# Altium schematic sheet TK512_Optisk_Mottaker.SchDoc: TK512 Optisk Mottaker
size A3; Author: Øystein Smith; Organization: Omega Verksted; DocumentNumber: 6; Revision: 0; SheetNumber: 6; SheetTotal: 20
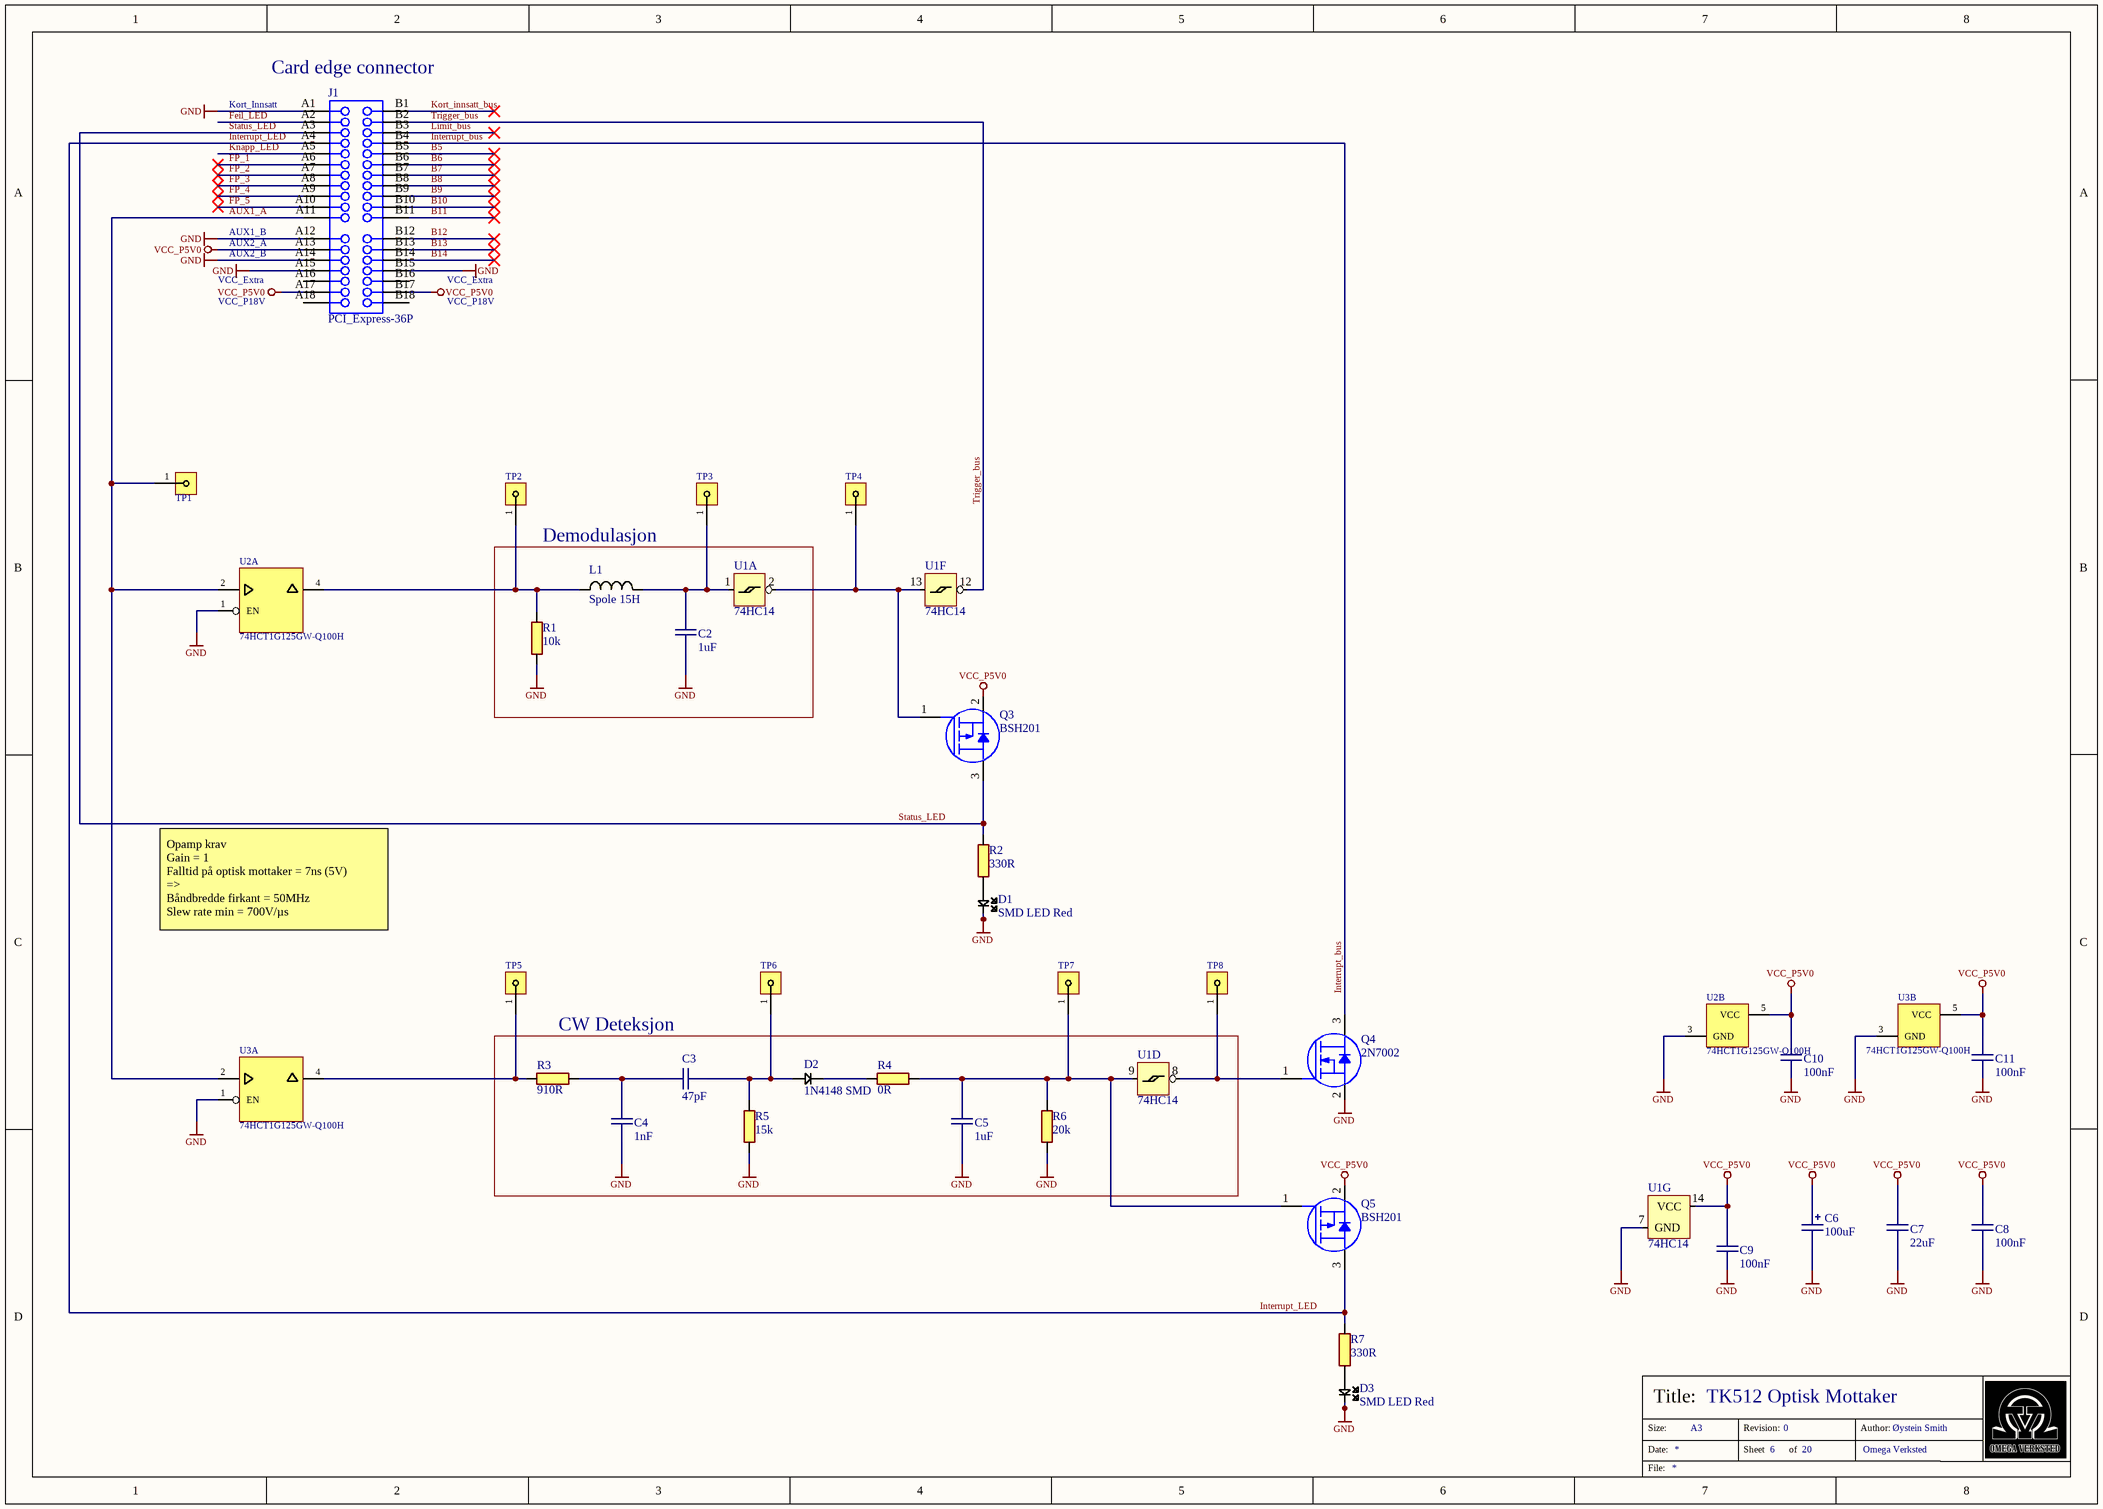
[diagram p0: TK512_Optisk_Mottaker.SchDoc]

## Parts
C2  1uF  [CAPC1206(3216)170_N]
C3  47pF  [CAPC0603(1608)55_N]
C4  1nF  [CAPC0603(1608)55_N]
C5  1uF  [CAPC0805(2012)100_N]
C6  100uF  [CAPPR25D06H11]
C7  22uF  [CAPC1206(3216)170_N]
C8  100nF  [CAPC0603(1608)55_N]
C9  100nF  [CAPC0603(1608)55_N]
C10  100nF  [CAPC0603(1608)55_N]
C11  100nF  [CAPC0603(1608)55_N]
D1  SMD LED Red  [I_LEDC0603(1608)_N]
D2  1N4148 SMD  [SOD123]
D3  SMD LED Red  [I_LEDC0603(1608)_N]
J1  PCI_Express-36P  [PCIeX1-GF-2D-1000-1K-O36]
L1  Spole 15H  [INDP3225X20N]
Q3  BSH201  [SOT23-3_N]
Q4  2N7002  [SOT323_N]
Q5  BSH201  [SOT23-3_N]
R1  10k  [RESC0603(1608)_N]
R2  330R  [RESC0603(1608)_N]
R3  910R  [RESC0603(1608)_N]
R4  0R  [RESC0603(1608)_N]
R5  15k  [RESC0603(1608)_N]
R6  20k  [RESC0603(1608)_N]
R7  330R  [RESC0603(1608)_N]
TP1  Header1x1  [HDRV1W64P254_1X1_254X254X900B]  (value not drawn)
TP2  Header1x1  [HDRV1W64P254_1X1_254X254X900B]  (value not drawn)
TP3  Header1x1  [HDRV1W64P254_1X1_254X254X900B]  (value not drawn)
TP4  Header1x1  [HDRV1W64P254_1X1_254X254X900B]  (value not drawn)
TP5  Header1x1  [HDRV1W64P254_1X1_254X254X900B]  (value not drawn)
TP6  Header1x1  [HDRV1W64P254_1X1_254X254X900B]  (value not drawn)
TP7  Header1x1  [HDRV1W64P254_1X1_254X254X900B]  (value not drawn)
TP8  Header1x1  [HDRV1W64P254_1X1_254X254X900B]  (value not drawn)
U1  74HC14  [SOIC-14]  (parts A,D,F,G of 7)
U2  74HCT1G125GW-Q100H  [SOT95P285X110-5N]  (parts A,B of 2)
U3  74HCT1G125GW-Q100H  [SOT95P285X110-5N]  (parts A,B of 2)

## Blocks framed on the sheet
Demodulasjon: C2 L1 R1 U1
CW Deteksjon: C3-C5 D2 R3-R6 U1

## Nets
GND: C2.1 C4.1 C5.1 C6.1 C7.1 C8.1 C9.1 C10.1 C11.1 D1.2 D3.2 J1.A1 J1.A12 J1.A14 J1.A15 J1.B15 Q4.2(Source) R1.2 R5.1 R6.1 U1.7(GND) U2.1(EN) U2.3(GND) U3.1(EN) U3.3(GND)
VCC_P5V0: C6.2 C7.2 C8.2 C9.2 C10.2 C11.2 J1.A13 J1.A17 J1.B17 Q3.2(Source) Q5.2(Source) U1.14(VCC) U2.5(VCC) U3.5(VCC)
AUX1_A: J1.A11 TP1.1 U2.2(IN) U3.2(IN)
B5: J1.B5
B6: J1.B6
B7: J1.B7
B8: J1.B8
B9: J1.B9
B10: J1.B10
B11: J1.B11
B12: J1.B12
B13: J1.B13
B14: J1.B14
Feil_LED: J1.A2
FP_1: J1.A6
FP_2: J1.A7
FP_3: J1.A8
FP_4: J1.A9
FP_5: J1.A10
Interrupt_bus: J1.B4 Q4.3(Drain)
Interrupt_LED: J1.A4 Q5.3(Drain) R7.2
Knapp_LED: J1.A5
Kort_innsatt_bus: J1.B1
Limit_bus: J1.B3
Status_LED: J1.A3 Q3.3(Drain) R2.2
Trigger_bus: J1.B2 U1.12
NetC2_2: C2.2 L1.2 TP3.1 U1.1
NetC3_1: C3.1 D2.1(A) R5.2 TP6.1
NetC3_2: C3.2 C4.2 R3.2
NetC5_2: C5.2 Q5.1(Gate) R4.2 R6.2 TP7.1 U1.9
NetD1_1: D1.1 R2.1
NetD2_2: D2.2(K) R4.1
NetD3_1: D3.1 R7.1
NetL1_1: L1.1 R1.1 TP2.1 U2.4(OUT)
NetQ3_1: Q3.1(Gate) TP4.1 U1.2 U1.13
NetQ4_1: Q4.1(Gate) TP8.1 U1.8
NetR3_1: R3.1 TP5.1 U3.4(OUT)

Not connected (* = marked no-connect by the designer): J1 A16 A18 B16 B18

## Notes on the sheet
- (near J1) Kort_Innsatt
- (near J1) Card edge connector
- AUX1_B
- AUX2_A
- VCC_Extra
- VCC_P18V
- AUX2_B
- Opamp krav
  Gain = 1
  Falltid på optisk mottaker = 7ns (5V)
  =>
  Båndbredde firkant = 50MHz
  Slew rate min = 700V/µs
- Size:
- Date:
- Title:
- A3
- Revision:
- Sheet
- of
- Author:
- File:

## Library data of the parts
C2 = 5154: X7R 50V; id: 5154; pakke_opprettet_av: 815; leverandor_varenr: 1759454; pris: 2; nokkelord: Kondensator, capacitor; produsent: Multicomp; leverandor: Farnell; pakketype: 1206; pakke_opprettet: 11/02/2015 13:21:22; symbol_opprettet_av: 815; symbol_opprettet: 14/11/2014 20:19:34; navn: 1uF; komponenttype: 2
C3 = 5155: NP0 50V 5%; id: 5155; pakke_opprettet_av: 815; pris: 1; nokkelord: Capacitor Cap Kondis; pakketype: 0603; komponenttype: 2; leverandor: Farnell; leverandor_varenr: 2496905; produsent: WALSIN; pakke_opprettet: 18/02/2015 14:18:13; symbol_opprettet_av: 815; symbol_opprettet: 14/11/2014 20:19:34; navn: 47pF
C4 = 3687: X7R 50V 5%; id: 3687; pakke_opprettet_av: 815; leverandor_varenr: 2310598; pris: 1; nokkelord: Kondensator, Capacitor, CAP; produsent: Multicomp; leverandor: Farnell; pakketype: 0603; komponenttype: 2; pakke_opprettet: 18/02/2015 14:18:13; symbol_opprettet_av: 815; symbol_opprettet: 14/11/2014 20:19:34; navn: 1nF
C5 = 5303: X7R 50V 10%; id: 5303; pakke_opprettet_av: 815; leverandor_varenr: 1735541; pris: 4; nokkelord: Kondensator, capacitor; produsent: Murata; leverandor: Farnell; pakketype: 0805; komponenttype: 2; pakke_opprettet: 14/11/2014 20:52:01; symbol_opprettet_av: 815; symbol_opprettet: 14/11/2014 20:19:34; navn: 1uF
C6 = 4858: 25V 2.5mm pitch; id: 4858; rad: 7; rom: OV; lager_type: Fremlager; dybde: 1; hylle: 4; antall: 38; pakke_opprettet_av: 815; leverandor_varenr: 1848439; pris: 2; nokkelord: Cap, Kondensator; produsent: Panasonic; leverandor: Farnell; pakketype: CAPPR; pakke_opprettet: 28/06/2014 17:35:52; symbol_opprettet_av: 815; symbol_opprettet: 28/06/2014 15:26:13; navn: 100uF; komponenttype: 2
C7 = 5192: 10V 10% Tantalum; id: 5192; pakke_opprettet_av: 815; leverandor_varenr: 1457420; pris: 3; nokkelord: Capacitor Cap Kondis; produsent: Kemet; leverandor: Farnell; pakketype: 1206; komponenttype: 2; pakke_opprettet: 11/02/2015 13:21:22; symbol_opprettet_av: 815; symbol_opprettet: 14/11/2014 20:19:34; navn: 22uF
C8-C11 = 5152: X7R 50V 5%; id: 5152; pakke_opprettet_av: 815; leverandor_varenr: 1759122; pris: 1; nokkelord: Kondensator, Capacitor, CAP; produsent: Multicomp; leverandor: Farnell; pakketype: 0603; rad: 21; rom: OV; lager_type: Baklager; dybde: 0; antall: 1000; komponenttype: 2; pakke_opprettet: 18/02/2015 14:18:13; symbol_opprettet_av: 815; symbol_opprettet: 14/11/2014 20:19:34; navn: 100nF; hylle: 0
D1 D3 = 5143: SMD; pakke_opprettet_av: 815; pris: 1; pakketype: 0603; id: 5143; rad: 0; rom: OV; lager_type: Fremlager; dybde: 2; hylle: 6; antall: 50; leverandor_varenr: 8554641; produsent: Avago; leverandor: Farnell; komponenttype: 9; navn: SMD LED Red; pakke_opprettet: 06/07/2014 18:55:44; symbol_opprettet_av: 815; symbol_opprettet: 06/07/2014 18:59:47; nokkelord: SMD
D2 = 4485: SMD signaldiode; id: 4485; rad: 3; rom: OV; lager_type: Fremlager; dybde: 2; antall: 894; pakke_opprettet_av: 1165; symbol_opprettet_av: 815; leverandor_varenr: 8150206; pris: 1; produsent: Taiwan Semiconductor; leverandor: Farnell; komponenttype: 9; hylle: 2; pakke_opprettet: 11/05/2018 20:10:55; symbol_opprettet: 28/06/2014 15:10:17; navn: 1N4148 SMD; pakketype: SOD123
J1 = 3037: PCI express PCB kortkankonnektor; pakke_opprettet_av: 815; pris: 0; id: 3037; komponenttype: 11; produsent: PCB feature; navn: PCIeX1-GF-2D-1000-1K-O36; pakke_opprettet: 07/06/2015 17:49:10; symbol_opprettet_av: 815; symbol_opprettet: 06/07/2014 17:26:37; pakketype: -
L1 = 6201: Wirewound Inductor, 15 µH, 2.8 ohm, 20 MHz, 130 mA; id: 6201; pakke_opprettet_av: 924; pris: 4; pakketype: 1210; leverandor_varenr: 2747875; nokkelord: Spole, coil, inductor, wirewound; produsent: TDK; leverandor: Farnell; komponenttype: 3; pakke_opprettet: 26/05/2015 23:51:10; symbol_opprettet_av: 924; symbol_opprettet: 27/05/2015 00:20:21; navn: Spole 15H
Q3 Q5 = 3085: P-Channel MOSFET 300mA; id: 3085; pakke_opprettet_av: 815; symbol_opprettet_av: 1150; leverandor_varenr: 1758073; pris: 3; produsent: NXP Semiconductors; leverandor: Farnell; pakketype: SOT; rom: OV; lager_type: Fremlager; dybde: 0; antall: 51; komponenttype: 4; Status: New; pakke_opprettet: 08/07/2014 20:37:25; symbol_opprettet: 14/09/2016 17:47:57; navn: BSH201; rad: 3; hylle: 3
Q4 = 3075: N-Channel MOSFET 300mA; id: 3075; rad: 2; rom: OV; lager_type: Fremlager; dybde: 0; hylle: 3; antall: 810; pakke_opprettet_av: 1165; symbol_opprettet_av: 774; leverandor_varenr: 1829184; pris: 1; produsent: Nexperia; leverandor: Farnell; pakketype: SOT-323; komponenttype: 4; pakke_opprettet: 12/05/2018 20:42:12; symbol_opprettet: 11/07/2014 23:17:04; navn: 2N7002
R1 = 5264: 0.1W 1% Thick film resistor; id: 5264; rad: 0; rom: OV; lager_type: Fremlager; dybde: 72; hylle: 2; antall: 4; pakke_opprettet_av: 815; pakketype: 0603; leverandor_varenr: 2447230; nokkelord: Resistor Motstand; produsent: Multicomp; leverandor: Farnell; komponenttype: 1; pakke_opprettet: 08/07/2014 21:15:30; symbol_opprettet_av: 815; symbol_opprettet: 08/07/2014 21:16:33; navn: 10k; pris: 0
R2 R7 = 5343: 0.1W 1% Thick film resistor; rad: 0; rom: OV; lager_type: Fremlager; dybde: 36; hylle: 2; antall: 45; pakke_opprettet_av: 815; nokkelord: Resistor Motstand; pakketype: 0603; id: 5343; leverandor_varenr: 2447339; produsent: Multicomp; leverandor: Farnell; komponenttype: 1; navn: 330R; pakke_opprettet: 08/07/2014 21:15:30; symbol_opprettet_av: 815; symbol_opprettet: 08/07/2014 21:16:33; pris: 0
R3 = 5336: 0.1W 1% Thick film resistor; id: 5336; rad: 0; rom: OV; lager_type: Fremlager; dybde: 47; hylle: 2; antall: 15; pakke_opprettet_av: 815; pakketype: 0603; komponenttype: 1; leverandor: Farnell; leverandor_varenr: 2447448; produsent: Multicomp; pakke_opprettet: 08/07/2014 21:15:30; symbol_opprettet_av: 815; symbol_opprettet: 08/07/2014 21:16:33; navn: 910R; pris: 0
R4 = 3646: 0.1W 1% Thick film resistor, Jumper; id: 3646; pakke_opprettet_av: 815; pris: 0; nokkelord: smd, 0603, motstand; pakketype: 0603; produsent: multicomp; rad: -1; rom: OV; lager_type: Fremlager; hylle: 2; antall: 450; leverandor_varenr: 2447060; leverandor: Farnell; komponenttype: 1; pakke_opprettet: 08/07/2014 21:15:30; symbol_opprettet_av: 815; symbol_opprettet: 08/07/2014 21:16:33; navn: 0R; dybde: 0
R5 = 5347: 0.1W 1% Thick film resistor; id: 5347; rad: -1; rom: OV; lager_type: Fremlager; dybde: 76; hylle: 2; antall: 4; pakke_opprettet_av: 815; pris: 0; pakketype: 0603; komponenttype: 1; leverandor: Farnell; leverandor_varenr: 2447226; produsent: Multicomp; pakke_opprettet: 08/07/2014 21:15:30; symbol_opprettet_av: 815; symbol_opprettet: 08/07/2014 21:16:33; navn: 15k
R6 = 5357: 0.1W 1% Thick film resistor; id: 5357; rad: -1; rom: OV; lager_type: Fremlager; dybde: 79; hylle: 2; antall: 3; pakke_opprettet_av: 815; pris: 0; pakketype: 0603; komponenttype: 1; leverandor: Farnell; leverandor_varenr: 2447293; produsent: Multicomp; pakke_opprettet: 08/07/2014 21:15:30; symbol_opprettet_av: 815; symbol_opprettet: 08/07/2014 21:16:33; navn: 20k
TP1-TP8 = 5093: 2,54mm pitch; id: 5093; pakke_opprettet_av: 815; pris: 1; pakketype: TH; komponenttype: 11; pakke_opprettet: 13/11/2014 12:30:32; symbol_opprettet_av: 815; symbol_opprettet: 13/11/2014 10:58:46; navn: Header 1x1
U1 = 4400: Hex Schmitt trigger; id: 4400; pakke_opprettet_av: 815; leverandor_varenr: 1607772; pris: 4; nokkelord: Logikk; produsent: ON Semiconductor; leverandor: Farnell; pakketype: SOIC; komponenttype: 8; pakke_opprettet: 28/06/2014 18:13:44; symbol_opprettet_av: 815; symbol_opprettet: 28/06/2014 15:23:38; navn: 74HC14
U2 U3 = 3665: Buffer / Line Driver, 74HCT1G125, 4.5 V to 5.5 V, TSSOP-5; id: 3665; pakke_opprettet_av: 774; symbol_opprettet_av: 815; leverandor_varenr: 1105927; pris: 1; produsent: NXP Semiconductors; leverandor: Farnell; pakketype: TSSOP; komponenttype: 8; pakke_opprettet: 22/08/2014 14:47:08; symbol_opprettet: 09/02/2017 19:02:38; navn: 74HCT1G125GW-Q100H